# EAGLE design driver (EAGLE 9.6.2)
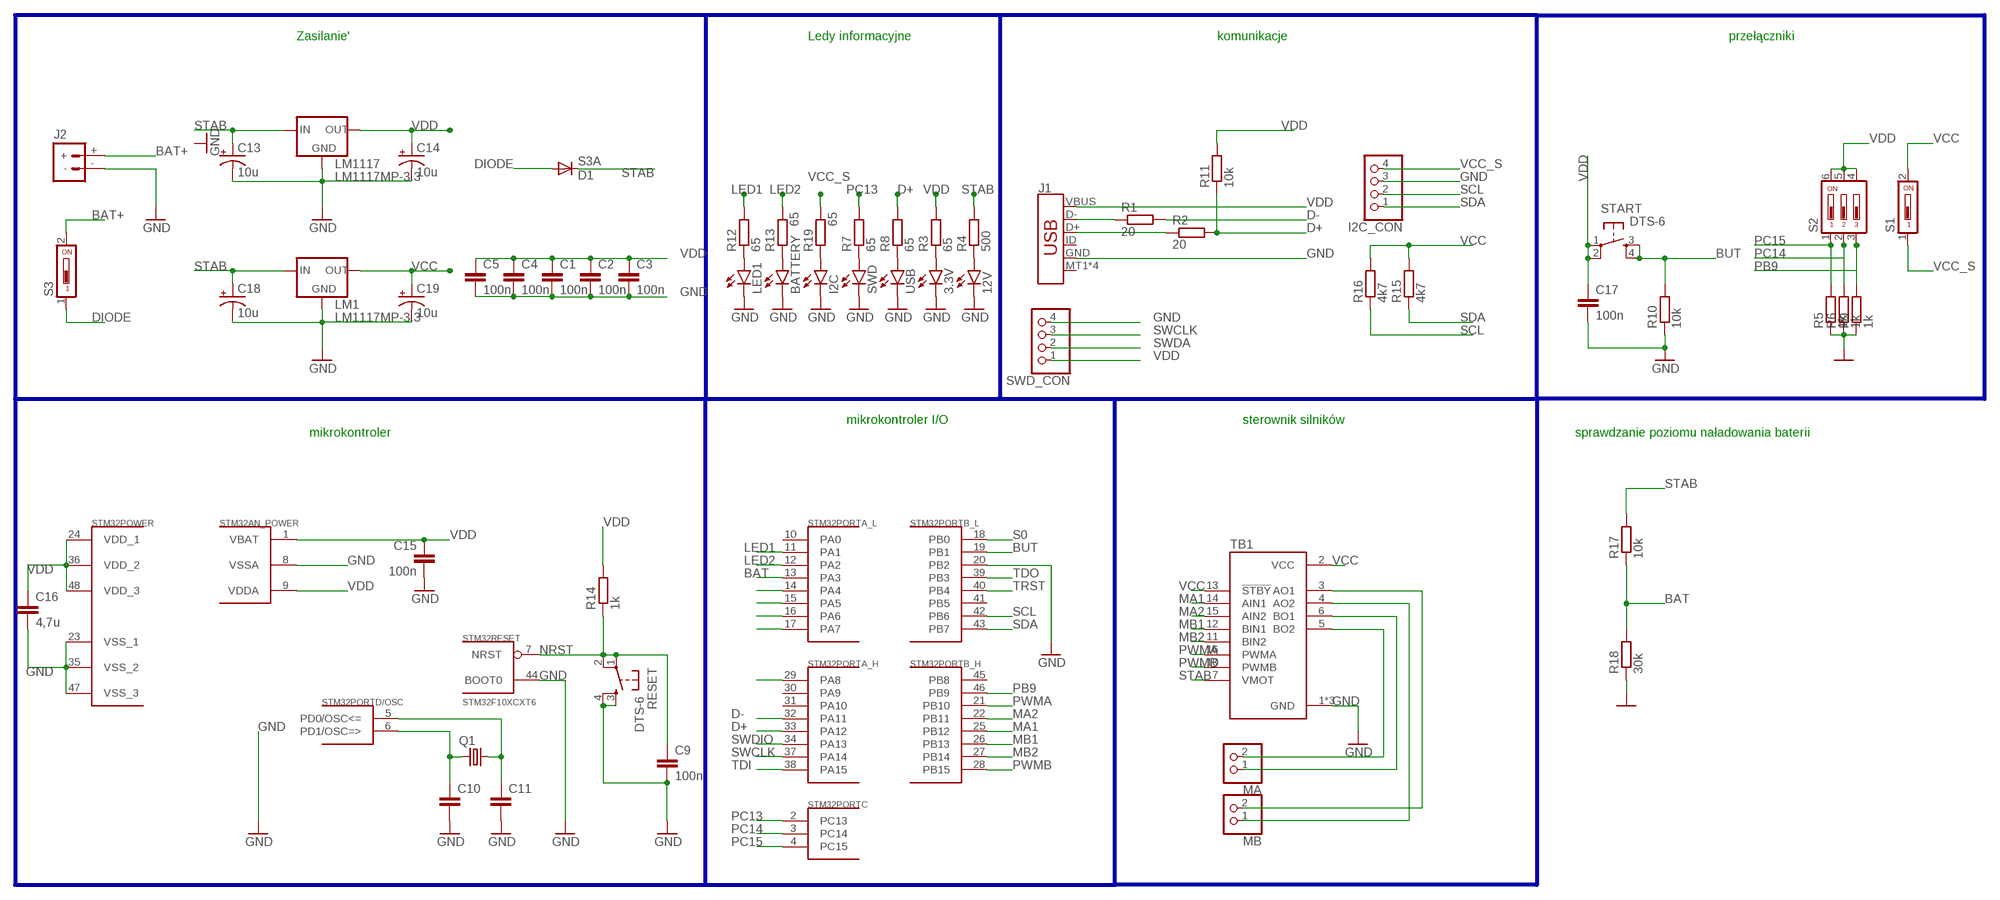
[diagram p0: schematic, sheet 1]

## Parts
3.3V  LEDCHIPLED_0805  [CHIPLED_0805]
12V  LEDCHIPLED_0805  [CHIPLED_0805]
BATTERY  LEDCHIPLED_0805  [CHIPLED_0805]
C1  100n  C-EUC0603  [C0603]
C2  100n  C-EUC0603  [C0603]
C3  100n  C-EUC0603  [C0603]
C4  100n  C-EUC0603  [C0603]
C5  100n  C-EUC0603  [C0603]
C9  100n  C-EUC0603  [C0603]
C10  C-EUC0603  [C0603]
C11  C-EUC0603  [C0603]
C13  10u  CPOL-USCT3528  [CT3528]
C14  10u  CPOL-USCT3528  [CT3528]
C15  100n  C-EUC0603  [C0603]
C16  4,7u  C-EUC0603  [C0603]
C17  100n  C-EUC0603  [C0603]
C18  10u  CPOL-USCT3528  [CT3528]
C19  10u  CPOL-USCT3528  [CT3528]
D1  S3A  [DO214AB]
I2C  LEDCHIPLED_0805  [CHIPLED_0805]
I2C_CON  PINHD-1X4  [1X04]
J1  USB_MICRO-B_SMT  [USB-MICROB]
J2  BATTERY_CONN_DEANS  [DEANS]
LED1  LEDCHIPLED_0805  [CHIPLED_0805]
LM1  LM1117MP-3.3  [SOT223]
LM1117  LM1117MP-3.3  [SOT223]
MA  PINHD-1X2/90  [1X02/90]
MB  PINHD-1X2/90  [1X02/90]
Q1  KX-7  [3.2X2.5_KX-7]
R1  20  R-EU_R0805  [R0805]
R2  20  R-EU_R0805  [R0805]
R3  65  R-EU_R0805  [R0805]
R4  500  R-EU_R0805  [R0805]
R5  1k  R-EU_R0805  [R0805]
R6  1k  R-EU_R0805  [R0805]
R7  65  R-EU_R0805  [R0805]
R8  65  R-EU_R0805  [R0805]
R9  1k  R-EU_R0805  [R0805]
R10  10k  R-EU_R0805  [R0805]
R11  10k  R-EU_R0805  [R0805]
R12  65  R-EU_R0805  [R0805]
R13  65  R-EU_R0805  [R0805]
R14  1k  R-EU_R0805  [R0805]
R15  4k7  R-EU_R0805  [R0805]
R16  4k7  R-EU_R0805  [R0805]
R17  10k  R-EU_R0805  [R0805]
R18  30k  R-EU_R0805  [R0805]
R19  65  R-EU_R0805  [R0805]
RESET  DTS-6  [DTS-6]
S1  SD4-01  [SD4-01]
S2  DP03  [DP-03]
S3  SD4-01  [SD4-01]
START  DTS-6  [DTS-6]
STM32  STM32F10XCXT6  [TQFP48]
SWD  LEDCHIPLED_0805  [CHIPLED_0805]
SWD_CON  PINHD-1X4  [1X04]
TB1  POLOLU-713  [SHIELD_POLOLU-713]
USB  LEDCHIPLED_0805  [CHIPLED_0805]

## Nets
BAT: R17.1 R18.2 STM32.13(PORTA_L:PA3)
BAT+: J2.+ S3.2
BUT: R10.2 START.3 START.4 STM32.19(PORTB_L:PB1)
D+: R2.2 R8.2 R11.1 STM32.33(PORTA_H:PA12)
D-: R1.2 STM32.32(PORTA_H:PA11)
DIODE: D1.A S3.1
GND: 3.3V.C 12V.C BATTERY.C C1.2 C2.2 C3.2 C4.2 C5.2 C9.2 C10.2 C11.2 C13.- C14.- C15.2 C16.2 C17.2 C18.- C19.- I2C.C I2C_CON.3 J1.GND J2.- LED1.C LM1.1(GND) LM1117.1(GND) R5.1 R6.1 R9.1 R10.1 R18.1 RESET.3 RESET.4 STM32.8(AN_POWER:VSSA) STM32.20(PORTB_L:PB2) STM32.23(POWER:VSS_1) STM32.35(POWER:VSS_2) STM32.44(RESET:BOOT0) STM32.47(POWER:VSS_3) SWD.C SWD_CON.4 TB1.1(GND) TB1.8(GND) TB1.9(GND) USB.C
LED1: R12.2 STM32.11(PORTA_L:PA1)
LED2: R13.2 STM32.12(PORTA_L:PA2)
MA1: STM32.25(PORTB_H:PB12) TB1.14(AIN1)
MA2: STM32.22(PORTB_H:PB11) TB1.15(AIN2)
MB1: STM32.26(PORTB_H:PB13) TB1.12(BIN1)
MB2: STM32.27(PORTB_H:PB14) TB1.11(BIN2)
N$1: 3.3V.A R3.1
N$2: 12V.A R4.1
N$3: C11.1 Q1.1 STM32.5(PORTD/OSC:PD0/OSC<=)
N$4: C10.1 Q1.3 STM32.6(PORTD/OSC:PD1/OSC=>)
N$5: LED1.A R12.1
N$6: J1.D+ R2.1
N$7: J1.D- R1.1
N$8: BATTERY.A R13.1
N$9: I2C.A R19.1
N$10: R7.1 SWD.A
N$11: R8.1 USB.A
N$17: STM32.29(PORTA_H:PA8)
N$42: MA.2 TB1.5(BO2)
N$43: MA.1 TB1.6(BO1)
N$44: MB.1 TB1.4(AO2)
N$45: MB.2 TB1.3(AO1)
NRST: C9.1 R14.1 RESET.1 RESET.2 STM32.7(RESET:NRST)
PB9: R9.2 S2.3 STM32.46(PORTB_H:PB9)
PC13: R7.2 STM32.2(PORTC:PC13)
PC14: R6.2 S2.2 STM32.3(PORTC:PC14)
PC15: R5.2 S2.1 STM32.4(PORTC:PC15)
PWMA: STM32.21(PORTB_H:PB10) TB1.16(PWMA)
PWMB: STM32.28(PORTB_H:PB15) TB1.10(PWMB)
S0: STM32.18(PORTB_L:PB0)
S1: STM32.17(PORTA_L:PA7)
S2: STM32.16(PORTA_L:PA6)
S3: STM32.15(PORTA_L:PA5)
S4: STM32.14(PORTA_L:PA4)
SCL: I2C_CON.2 R16.1 STM32.42(PORTB_L:PB6)
SDA: I2C_CON.1 R15.1 STM32.43(PORTB_L:PB7)
STAB: C13.+ C18.+ D1.C LM1.3(IN) LM1117.3(IN) R4.2 R17.2 TB1.7(VMOT)
SWCLK: STM32.37(PORTA_H:PA14) SWD_CON.3
SWDA: SWD_CON.2
SWDIO: STM32.34(PORTA_H:PA13)
TDI: STM32.38(PORTA_H:PA15)
TDO: STM32.39(PORTB_L:PB3)
TRST: STM32.40(PORTB_L:PB4)
VCC: C19.+ LM1.2(OUT) LM1.4(OUT) R15.2 R16.2 S1.2 TB1.2(VCC) TB1.13(!STBY)
VCC_S: I2C_CON.4 R19.2 S1.1
VDD: C1.1 C2.1 C3.1 C4.1 C5.1 C14.+ C15.1 C16.1 C17.1 J1.VBUS LM1117.2(OUT) LM1117.4(OUT) R3.2 R11.2 R14.2 S2.4 S2.5 S2.6 START.1 START.2 STM32.1(AN_POWER:VBAT) STM32.9(AN_POWER:VDDA) STM32.24(POWER:VDD_1) STM32.36(POWER:VDD_2) STM32.48(POWER:VDD_3) SWD_CON.1
Unconnected: J1.ID J1.MT1(SHIELD) J1.MT2(SHIELD) J1.P$1(SHIELD) J1.P$2(SHIELD) STM32.10(PORTA_L:PA0) STM32.30(PORTA_H:PA9) STM32.31(PORTA_H:PA10) STM32.41(PORTB_L:PB5) STM32.45(PORTB_H:PB8)

## Buses
B$1

## Notes on the sheet
- Zasilanie' | Ledy informacyjne | komunikacje | przełączniki
- mikrokontroler I/O | sterownik silników
- mikrokontroler | sprawdzanie poziomu naładowania baterii

## Library data of the parts
3.3V 12V BATTERY I2C LED1 SWD USB = led:LED: LED OSRAM: - CHIPLED LG R971, LG N971, LY N971, LG Q971, LY Q971, LO R971, LY R971 LH N974, LH R974 LS Q976, LO Q976, LY Q976 LO Q996 - Hyper CHIPLED LW Q18S LB Q993, LB Q99A, LB R99A - SideLED LS A670, LO A670, LY A670, LG A670, LP A670 LB A673, LV A673, LT A673, LW A673 LH A674 LY A675 LS A676, LA A676, LO A676, LY A676, LW A676 LS A679, LY A679, LG A679 - Hyper Micro SIDELED® LS Y876, LA Y876, LO Y876, LY Y876 LT Y87S - SmartLED LW L88C, LW L88S LB L89C, LB L89S, LG L890 LS L89K, LO L89K, LY L89K LS L896, LA L896, LO L896, LY L896 - TOPLED LS T670, LO T670, LY T670, LG T670, LP T670 LSG T670, LSP T670, LSY T670, LOP T670, LYG T670 LG T671, LOG T671, LSG T671 LB T673, LV T673, LT T673, LW T673 LH T674 LS T676, LA T676, LO T676, LY T676, LB T676, LH T676, LSB T676, LW T676 LB T67C, LV T67C, LT T67C, LS T67K, LO T67K, LY T67K, LW E67C LS E67B, LA E67B, LO E67B, LY E67B, LB E67C, LV E67C, LT E67C LW T67C LS T679, LY T679, LG T679 LS T770, LO T770, LY T770, LG T770, LP T770 LB T773, LV T773, LT T773, LW T773 LH T774 LS E675, LA E675, LY E675, LS T675 LS T776, LA T776, LO T776, LY T776, LB T776 LHGB T686 LT T68C, LB T68C - Hyper Mini TOPLED® LB M676 - Mini TOPLED Santana® LG M470 LS M47K, LO M47K, LY M47K Source: http://www.osram.convergy.de LUXEON: - LUMILED® LXK2-PW12-R00, LXK2-PW12-S00, LXK2-PW14-U00, LXK2-PW14-V00 LXK2-PM12-R00, LXK2-PM12-S00, LXK2-PM14-U00 LXK2-PE12-Q00, LXK2-PE12-R00, LXK2-PE12-S00, LXK2-PE14-T00, LXK2-PE14-U00 LXK2-PB12-K00, LXK2-PB12-L00, LXK2-PB12-M00, LXK2-PB14-N00, LXK2-PB14-P00, LXK2-PB14-Q00 LXK2-PR12-L00, LXK2-PR12-M00, LXK2-PR14-Q00, LXK2-PR14-R00 LXK2-PD12-Q00, LXK2-PD12-R00, LXK2-PD12-S00 LXK2-PH12-R00, LXK2-PH12-S00 LXK2-PL12-P00, LXK2-PL12-Q00, LXK2-PL12-R00 Source: www.luxeon.com KINGBRIGHT: KA-3528ASYC Source: www.kingbright.com; SPICEPREFIX: D
C1-C5 C9-C11 C15-C17 = rcl:C-EU: CAPACITOR, European symbol; SPICEPREFIX: C
C13 C14 C18 C19 = rcl:CPOL-US: POLARIZED CAPACITOR, American symbol; SPICEPREFIX: C
D1 = s3x_10:S3*: S3A - S3N General Purpose Rectifiers Source: http://www.fairchildsemi.com/datasheets/S3/S3A.pdf; MF: Fairchild; MPN: S3A; OC_FARNELL: 1017803; OC_NEWARK: 58K2395
I2C_CON SWD_CON = pinhead:PINHD-1X4: PIN HEADER
J1 = SparkFun-Connectors:USB_MICRO-B: USB Type Micro-B Connector Male/female and PTH/SMT variants SparkFun Products: SparkFun microB USB Breakout <https://www.sparkfun.com/products/12035> SparkFun USB microB Plug Breakout <https://www.sparkfun.com/products/10031> SparkFun ESP8266 Thing <https://www.sparkfun.com/products/13231>; PROD_ID: CONN-09505; SF_ID: PRT-08533
J2 = SparkFun-Connectors:BATTERY_CONN: Battery Connectors Various footprints for battery connections SparkFun Products: Deans Connector -M/F Pair <https://www.sparkfun.com/products/11864>; SF_ID: PRT-11864
LM1 LM1117 = lm1117_11:LM1117?-*: 800mA Low-Dropout Linear Regulator Source: http://www.ti.com/lit/ds/symlink/lm1117-n.pdf; MF: Texas Instruments; MPN: LM1117MP-3.3; OC_FARNELL: 9778195; OC_NEWARK: 28X3416
MA MB = pinhead:PINHD-1X2: PIN HEADER
Q1 = crystal-geyer_V1_0:KX: Quartz Crystals (MHz) SMD: KX - Serie Model Size l/w/h [mm] Frequency Range Frequency Stability Temp. Range [°C] Load Capacitance AECQ 200 availabel Datasheet KX-4 KX-5 KX-6 KX-7 KX-9A KX-9B KX-12A KX-12B KX-13 KX-20 KX-K KX-KS 1.6/1.2/0.3 2.0/1.6/0.45 2.5/2.0/0.55 3.2/2.5/0.8 5.0/3.2/1.0 5.0/3.2/1.1 6.0/3.5/1.1 6.0/3.5/1.0 7.0/5.0 /1.3 11.6/5.5/1.6 12.3/4.5/4.2 12.3/4.5/3.2 24.0 ~ 80.0 MHz 16.0 ~ 80.0 MHz 12.0 ~ 80.0 MHz 8.0 ~ 60.0 MHz 7,68 ~ 300,0 MHz 8,0 ~ 50,0 MHz 8,0 ~ 150,0 MHz 8,0 ~ 50,0 MHz 6,0 ~ 160,0 MHz 3,579 ~ 25,0 MHz 3,579 ~ 70,0 MHz 3,579 ~ 70,0 MHz ±10 … ±50ppm ±10 … ±50ppm ±10 … ±50ppm ±10 … ±50ppm ±10 … ±50ppm ±10 … ±50ppm ±10 … ±50ppm ±10 … ±50ppm ±10 … ±50ppm ±50ppm ±10 … ±50ppm ±10 … ±50ppm (*) -40°C …+85°C (*) -40°C …+125°C (*) -40°C …+125°C (*) -40°C …+125°C (*) -40°C …+105°C (*) -40°C …+105°C (*) -40°C …+125°C (*) -40°C …+105°C (*) -40°C …+105°C (*) -40°C …+105°C (*) -40°C …+85°C (*) -40°C …+85°C 8, 8…16 8, 8…16 10, 8…16 12, 7…20 16, 10…20 16, 10…20 16, 10…20 16, 12…20 16, 12…20 16, 12…20 16, 12…30 16, 12…30 - yes yes yes - - - - - - - - KX-4.pdf <http://www.geyer-electronic.de/uploads/tx_userartikelfrequenz/GEYER-KX-4.pdf> KX-5.pdf <http://www.geyer-electronic.de/uploads/tx_userartikelfrequenz/GEYER-KX-5.pdf> KX-6.pdf <http://www.geyer-electronic.de/uploads/tx_userartikelfrequenz/GEYER-KX-6.pdf> KX-7.pdf <http://www.geyer-electronic.de/uploads/tx_userartikelfrequenz/GEYER-KX-7.pdf> KX-9A.pdf <http://www.geyer-electronic.de/uploads/tx_userartikelfrequenz/GEYER-KX-9A.pdf> KX-9B.pdf <http://www.geyer-electronic.de/uploads/tx_userartikelfrequenz/GEYER-KX-9B.pdf> KX-12A.pdf <http://www.geyer-electronic.de/uploads/tx_userartikelfrequenz/GEYER-KX-12A.pdf> KX-12B.pdf <http://www.geyer-electronic.de/uploads/tx_userartikelfrequenz/GEYER-KX-12B.pdf> KX-13.pdf <http://www.geyer-electronic.de/uploads/tx_userartikelfrequenz/GEYER-KX-13.pdf> KX-20.pdf <http://www.geyer-electronic.de/uploads/tx_userartikelfrequenz/GEYER-KX-20.pdf> KX-K.pdf <http://www.geyer-electronic.de/uploads/tx_userartikelfrequenz/GEYER-KX-K.pdf> KX-KS.pdf <http://www.geyer-electronic.de/uploads/tx_userartikelfrequenz/GEYER-KX-KS.pdf> <http://www.geyer-electronic.de/fileadmin/template/img/logo-geyer-electronic.png> Details see: http://www.geyer-electronic.de/Frequenz-Produkte.9.0.html Created 2016-06-07, Hans Locher 2016 (C) Geyer Quartz Technology KX4,KX5,KX6,KX7,KX9A,KX9B,KX12A,KX12B,KX13,KX20,KXK,KXKS;1612;2016;2520;3225;5032;6035;7050;11655;12345;1,6x1,2;2,0x1,6;2,5x2,0;3,2x2,5;5,0x3,2;6,0x3,5;7,0x5,0;11,6x5,5;12,3x4,5;12,3x4,5;1.6x1.2;2.0x1.6;2.5x2.0;3.2x2.5;5.0x3.2;6.0x3.5;7.0x5.0;11.6x5.5;12.3x4.5;12.3x4.5;
R1-R19 = rcl:R-EU_: RESISTOR, European symbol; SPICEPREFIX: R
RESET START = switch-tact:DTS-6
S1 S3 = switch-dil:SD4-01: DIL/CODE SWITCH; OC_FARNELL: unknown; OC_NEWARK: unknown
S2 = switch-dil:DP03: DIL/CODE SWITCH; MPN: MCDP03; OC_FARNELL: 1522004; OC_NEWARK: 74M2976
STM32 = stm32:STM32F10XCXT6: ST STM32F101/103 48pin LQFP
TB1 = POLOLU-713:POLOLU-713: DC-motor driver; IC: TB6612FNG; 100kHz; 1A; Uin mot: 4.5; AVAILABILITY: Unavailable; DESCRIPTION: DC-motor driver; IC: TB6612FNG; 100kHz; 1A; Uin mot: 4.5; MF: Pololu; MP: POLOLU-713; PACKAGE: None; PRICE: None

## Board
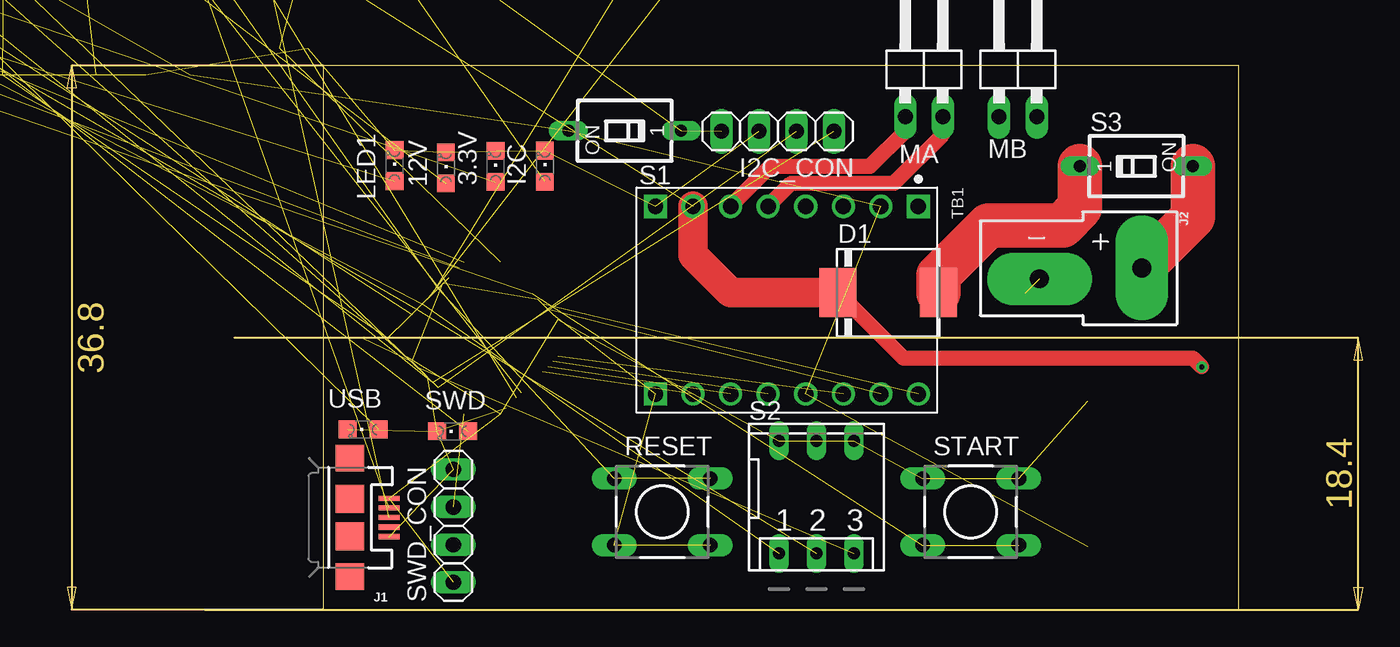
[diagram p1: board, top side]
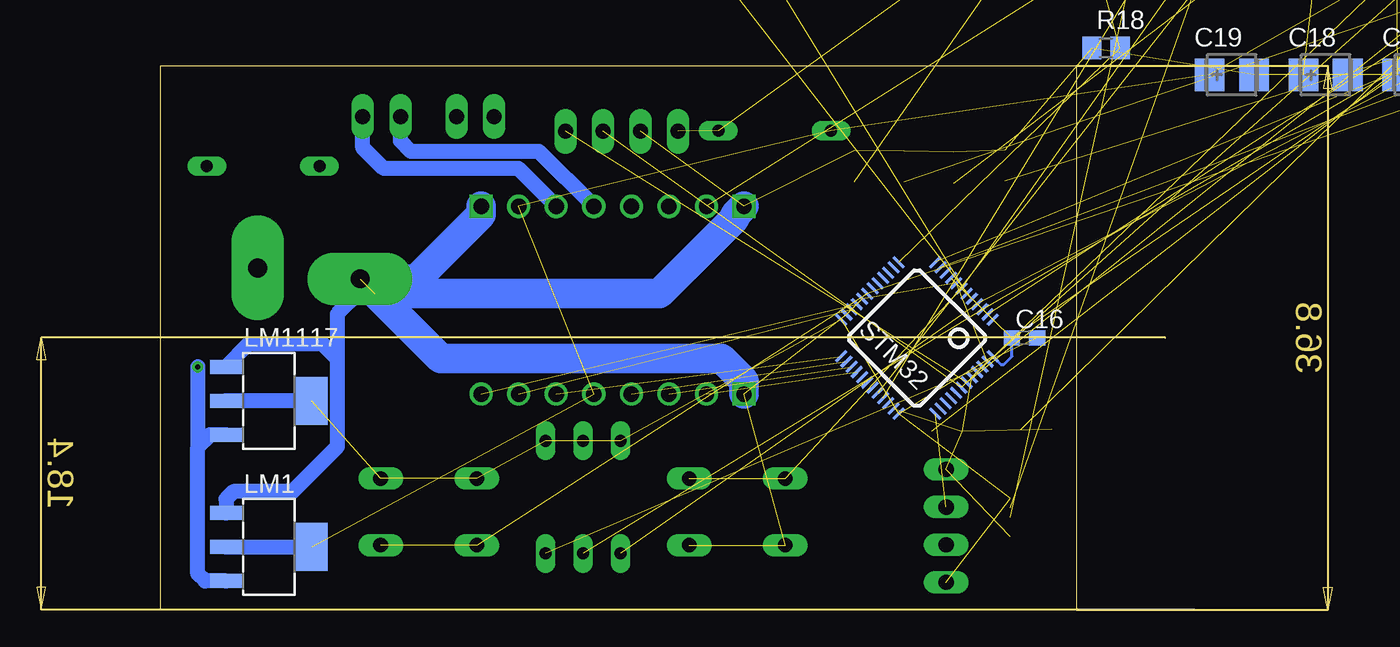
[diagram p2: board, bottom side, seen from below]

Size 61.94 x 36.8 mm. Coordinates in mm from the lower left corner, seen from the top.
Outline: 0,0 61.94,0 61.94,36.8 0,36.8 0,0
Copper layers (1*16): Top 0.035mm / dielectric 0.15mm / Bottom 0.035mm
Design rules "default": minimum track width 6mil, minimum drill 0.35mm, track to track 6mil, track to pad 6mil, pad to pad 6mil, via to via 6mil, smd to smd 6mil, copper to edge 40mil, drill to drill 6mil, minimum pad ring 10mil, minimum via ring 8mil, stop-mask expansion 4mil, vias tented up to drill 0mil, thermal gap 10mil

### Footprints (pad centres in the part's own frame; a part is rotated, then mirrored left to right if it is on the bottom)
CHIPLED_0805 = smd 1.2 x 1.2: A 0,-1.05; C 0,1.05
C0603 = smd 1.1 x 1: 1 -0.85,0; 2 0.85,0
CT3528 = smd 2 x 2.2: + -1.5,0; - 1.5,0
DO214AB = smd 2.5 x 3.3: A 3.4,0; C -3.4,0
1X04 = drill 1.016 long: 1 -3.81,0; 2 -1.27,0; 3 1.27,0; 4 3.81,0
USB-MICROB = smd 1.4 x 0.35: D+ -2.65,0; D- -2.65,-0.65; GND -2.65,1.3; ID -2.65,0.65; VBUS -2.65,-1.3 | smd 1.9 x 1.8: MT1 0,-4; MT2 0,4 | smd 1.9 x 1.9: P$1 0,-1.27; P$2 0,1.27
DEANS = drill 1.27 pad 3.556 long: + 0,0; - 0.737,-6.921
SOT223 = smd 0.95 x 2.15: 1 -2.3,-2.9; 2 0,-2.9; 3 2.3,-2.9 | smd 3.25 x 2.15: 4 0,2.9
1X02/90 = drill 1.016 long: 1 -1.27,-3.81; 2 1.27,-3.81
3.2X2.5_KX-7 = smd 1.3 x 1.1: 1 -1.15,-0.9; 2 1.15,-0.9; 3 1.15,0.9; 4 -1.15,0.9
R0805 = smd 1.3 x 1.5: 1 -0.95,0; 2 0.95,0
DTS-6 = drill 1 long: 1 -3.25,2.25; 2 3.25,2.25; 3 -3.25,-2.25; 4 3.25,-2.25
SD4-01 = drill 0.813 long: 1 0,-3.81; 2 0,3.81
DP-03 = drill 0.813 long: 1 -2.54,-3.81; 2 0,-3.81; 3 2.54,-3.81; 4 2.54,3.81; 5 0,3.81; 6 -2.54,3.81
TQFP48 = smd 0.2 x 1: 1 -2.75,-4.5; 2 -2.25,-4.5; 3 -1.75,-4.5; 4 -1.25,-4.5; 5 -0.75,-4.5; 6 -0.25,-4.5; 7 0.25,-4.5; 8 0.75,-4.5; 9 1.25,-4.5; 10 1.75,-4.5; 11 2.25,-4.5; 12 2.75,-4.5; 25 2.75,4.5; 26 2.25,4.5; 27 1.75,4.5; 28 1.25,4.5; 29 0.75,4.5; 30 0.25,4.5; 31 -0.25,4.5; 32 -0.75,4.5; 33 -1.25,4.5; 34 -1.75,4.5; 35 -2.25,4.5; 36 -2.75,4.5 | smd 1 x 0.2: 13 4.5,-2.75; 14 4.5,-2.25; 15 4.5,-1.75; 16 4.5,-1.25; 17 4.5,-0.75; 18 4.5,-0.25; 19 4.5,0.25; 20 4.5,0.75; 21 4.5,1.25; 22 4.5,1.75; 23 4.5,2.25; 24 4.5,2.75; 37 -4.5,2.75; 38 -4.5,2.25; 39 -4.5,1.75; 40 -4.5,1.25; 41 -4.5,0.75; 42 -4.5,0.25; 43 -4.5,-0.25; 44 -4.5,-0.75; 45 -4.5,-1.25; 46 -4.5,-1.75; 47 -4.5,-2.25; 48 -4.5,-2.75
SHIELD_POLOLU-713 = drill 1.04 square: 1 -6.35,8.89; 8 -6.35,-8.89; 9 6.35,-8.89 | drill 1.04: 2 -6.35,6.35; 3 -6.35,3.81; 4 -6.35,1.27; 5 -6.35,-1.27; 6 -6.35,-3.81; 7 -6.35,-6.35; 10 6.35,-6.35; 11 6.35,-3.81; 12 6.35,-1.27; 13 6.35,1.27; 14 6.35,3.81; 15 6.35,6.35; 16 6.35,8.89

### Placement (x,y rotation side)
3.3V  11.67,29.99 0 top
12V  8.31,29.89 0 top
BATTERY  -54.95,59.04 0 bottom  (outside the outline)
C1  -19.39,64.12 0 bottom  (outside the outline)
C2  -15.58,64.12 0 bottom  (outside the outline)
C3  -11.77,64.12 0 bottom  (outside the outline)
C4  -7.96,64.12 0 bottom  (outside the outline)
C5  -28.28,64.12 0 bottom  (outside the outline)
C9  -19.39,59.04 0 bottom  (outside the outline)
C10  -33.36,64.12 0 bottom  (outside the outline)
C11  -23.2,64.12 0 bottom  (outside the outline)
C13  -29.55,36.18 0 bottom  (outside the outline)
C14  -23.2,36.18 0 bottom  (outside the outline)
C15  -13.04,59.04 0 bottom  (outside the outline)
C16  3.51,18.39 0 bottom
C17  -6.69,59.04 0 bottom  (outside the outline)
C18  -16.85,36.18 0 bottom  (outside the outline)
C19  -10.5,36.18 0 bottom  (outside the outline)
D1  38.22,21.45 0 top
I2C  15,30 0 top
I2C_CON  30.75,32.37 180 top
J1  1.81,6.24 180 top
J2  55.37,23.12 270 top
LED1  4.83,30.04 0 top
LM1  54.61,4.24 270 bottom
LM1117  54.61,14.13 270 bottom
MA  40.64,37.18 0 top
MB  46.99,37.18 0 top
Q1  22.86,43.8 0 bottom  (outside the outline)
R1  -10.5,46.34 0 bottom  (outside the outline)
R2  -5.42,46.34 0 bottom  (outside the outline)
R3  -58.76,52.69 0 bottom  (outside the outline)
R4  -15.58,46.34 0 bottom  (outside the outline)
R5  -53.68,52.69 0 bottom  (outside the outline)
R6  -48.6,52.69 0 bottom  (outside the outline)
R7  -43.52,52.69 0 bottom  (outside the outline)
R8  -38.44,52.69 0 bottom  (outside the outline)
R9  -33.36,52.69 0 bottom  (outside the outline)
R10  -57.49,46.34 0 bottom  (outside the outline)
R11  -20.66,46.34 0 bottom  (outside the outline)
R12  -51.14,46.34 0 bottom  (outside the outline)
R13  -44.79,46.34 0 bottom  (outside the outline)
R14  -38.44,46.34 0 bottom  (outside the outline)
R15  -32.09,46.34 0 bottom  (outside the outline)
R16  -25.74,46.34 0 bottom  (outside the outline)
R17  -2,45 0 bottom  (outside the outline)
R18  -2,38 0 bottom
R19  -2,52 0 bottom  (outside the outline)
RESET  22.94,6.62 0 top
S1  20.4,32.4 90 top
S2  33.37,7.62 0 top
S3  55,30 270 top
START  43.8,6.62 0 top
STM32  10.78,18.38 135 bottom
SWD  8.76,12.07 90 top
SWD_CON  8.81,5.67 90 top
TB1  31.37,20.94 270 top
USB  2.71,12.19 90 top

### Tracks (layer width: path | path; a pad name or v marks a point on that pad's centre or on a via)
BAT  (2 unrouted)
BAT+
  Top 3: J2.+ 58.81,26.56 S3.2
BUT  (3 unrouted)
D+  (3 unrouted)
D-  (1 unrouted)
DIODE
  Top 3: S3.1 51.19,27.19 50,26 45,26 41.62,22.62 D1.A
GND  (39 unrouted)
  Bottom 1: 49.98,16.98 51,18 55.94,18 LM1117.1 | LM1.1 57.51,7.49 57,8 53,8 49.98,11.02 49.98,16.98 | 49.98,16.98 49.98,20 48.45,21.53 J2.-
  Bottom 2: TB1.9 22.48,15.48 24,17 43,17 48.38,22.38 | 48.38,22.38 J2.- | TB1.8 23.09,26.68 23.09,26.49 28.19,21.38 47.45,21.38 | TB1.1 40.26,26.74 44.62,22.38 48.38,22.38
LED1  (1 unrouted)
LED2  (1 unrouted)
MA1  (1 unrouted)
MA2  (1 unrouted)
MB1  (1 unrouted)
MB2  (1 unrouted)
N$1  (1 unrouted)
N$2  (1 unrouted)
N$3  (2 unrouted)
N$4  (2 unrouted)
N$5  (1 unrouted)
N$6  (1 unrouted)
N$7  (1 unrouted)
N$8  (1 unrouted)
N$9  (1 unrouted)
N$10  (1 unrouted)
N$11  (1 unrouted)
N$42
  Top 1: TB1.5 31.66,28.85 38.61,28.85 41.91,32.15 MA.2
N$43
  Top 1: TB1.6 30.27,30 37,30 39.37,32.37 MA.1
N$44
  Bottom 1: TB1.4 36.35,31 45,31 45.72,31.72 MB.1
N$45
  Bottom 1: TB1.3 37.74,29.85 46.85,29.85 48.26,31.26 MB.2
NRST  (4 unrouted)
PB9  (2 unrouted)
PC13  (1 unrouted)
PC14  (2 unrouted)
PC15  (2 unrouted)
PWMA  (1 unrouted)
PWMB  (1 unrouted)
SCL  (2 unrouted)
SDA  (2 unrouted)
STAB  (via drill 0.35)  (4 unrouted)
  Top 1: D1.C 39.27,17 58.85,17 v59.42,16.42
  Top 2: TB1.7 25.02,23.98 27.55,21.45 D1.C
  Bottom 1: LM1117.3 58.59,11.83 59.42,11 | 59.42,11 59.42,2.42 58.94,1.94 LM1.3 | v59.42,16.42 59.42,11
SWCLK  (1 unrouted)
VCC  (6 unrouted)
  Bottom 1: LM1.2 LM1.4
VCC_S  (2 unrouted)
VDD  (23 unrouted)
  Bottom 0.2: STM32.48 5.11,16.6 4.9,16.6 4.36,17.14 C16.1
  Bottom 1: LM1117.4 LM1117.2